# EasyEDA schematic SCH_Resert Circuit - 1.0_2021-10-20.json
TITLE: Sheet_1; REV: 1.0; Date: 2021-09-19; Sheet: 1/1; Drawn By: MarcosObel; Company: Your Company
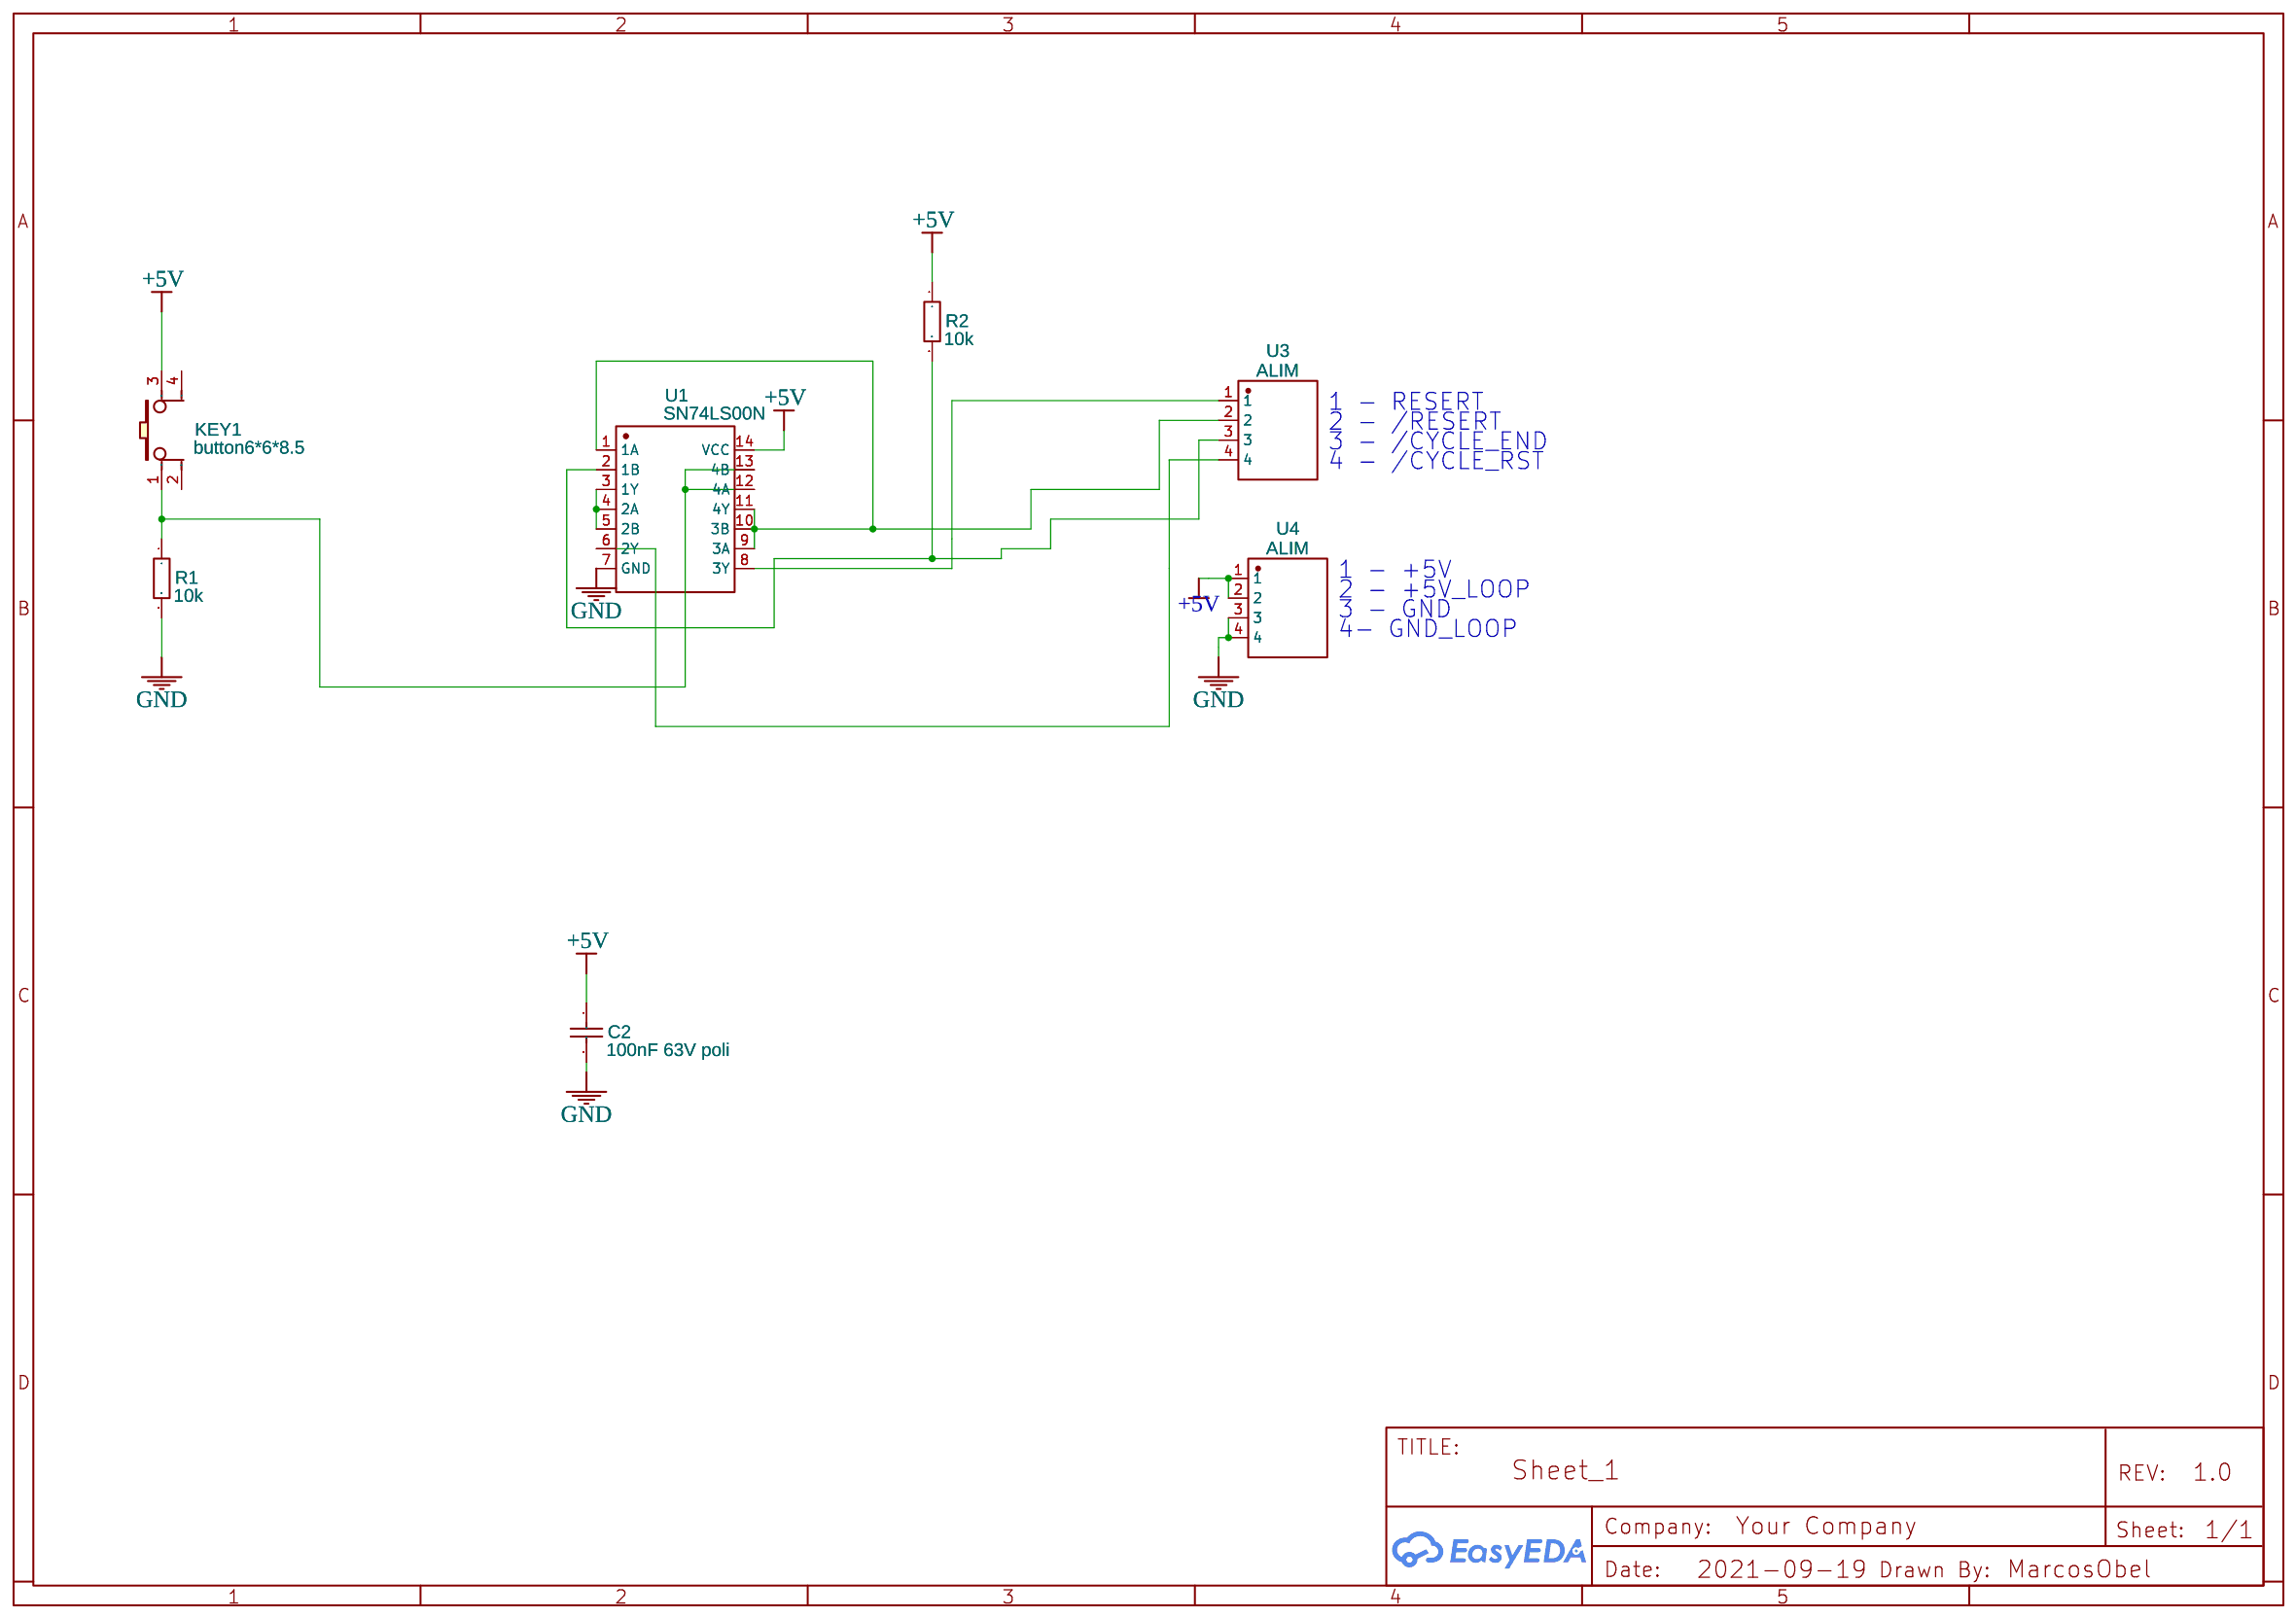
[diagram p0: schematic sheet]

## Parts
C2  100nF 63V poli  [CAP-TH_L5.5-W3.0-P5.00-D0.5]
KEY1  button6*6*8.5  [KEY-TH_4P-L6.0-W6.0-P4.50]
R1  10k  [RES-TH_BD2.3-L6.5-P10.50-D0.5]
R2  10k  [RES-TH_BD2.3-L6.5-P10.50-D0.5]
U1  SN74LS00N  [PDIP-14_L19.7-W6.6-P2.54-LS8.3-BL]
U3  ALIM  [HDR-TH_4P-P2.54-D1.0]
U4  ALIM  [HDR-TH_4P-P2.54-D1.0]

## Library data of the parts
C2 = 0.01uF(103) 100V: Supplier: LCSC; Manufacturer: ReliaPro; Supplier Part: C10722
KEY1 = button6*6*8.5: Supplier Part: C59980; Supplier: LCSC; Manufacturer: ReliaPro
R1 R2 = CF1/4W-3.9Ω±5% T52: Supplier: LCSC; Supplier Part: C119997; Manufacturer: Chian Chia Elec; Contributor: LCSC
U1 = SN74LS00N: Supplier: LCSC; Manufacturer: TI; Contributor: LCSC; Supplier Part: C181629; JLCPCB Part Class: Extended Part
U3 U4 = 171825-4: Supplier: LCSC; Supplier Part: C210162; Manufacturer: TE Connectivity; Contributor: LCSC; JLCPCB Part Class: Extended Part

## Nets
+5V: C2.1 KEY1.3 R2.1 U1.14(VCC) U4.1 U4.2
GND: C2.2 R1.2 U1.7(GND) U4.3 U4.4
Net-(KEY1-1): KEY1.1 R1.1 U1.12(4A) U1.13(4B)
Net-(R2-2): R2.2 U1.2(1B) U3.3
Net-(U1-1): U1.1(1A) U1.9(3A) U1.10(3B) U1.11(4Y) U3.2
Net-(U1-3): U1.3(1Y) U1.4(2A) U1.5(2B)
Net-(U1-6): U1.6(2Y) U3.4
Net-(U1-8): U1.8(3Y) U3.1

Not connected (* = marked no-connect by the designer): KEY1 2 4

## Notes on the sheet
- 1 - RESERT
- 2 - /RESERT
- 3 - /CYCLE_END
- 4 - /CYCLE_RST
- 1 - +5V
- 2 - +5V_LOOP
- 3 - GND
- 4- GND_LOOP
